# Altium schematic sheet Current_Sensors.SchDoc
size Letter
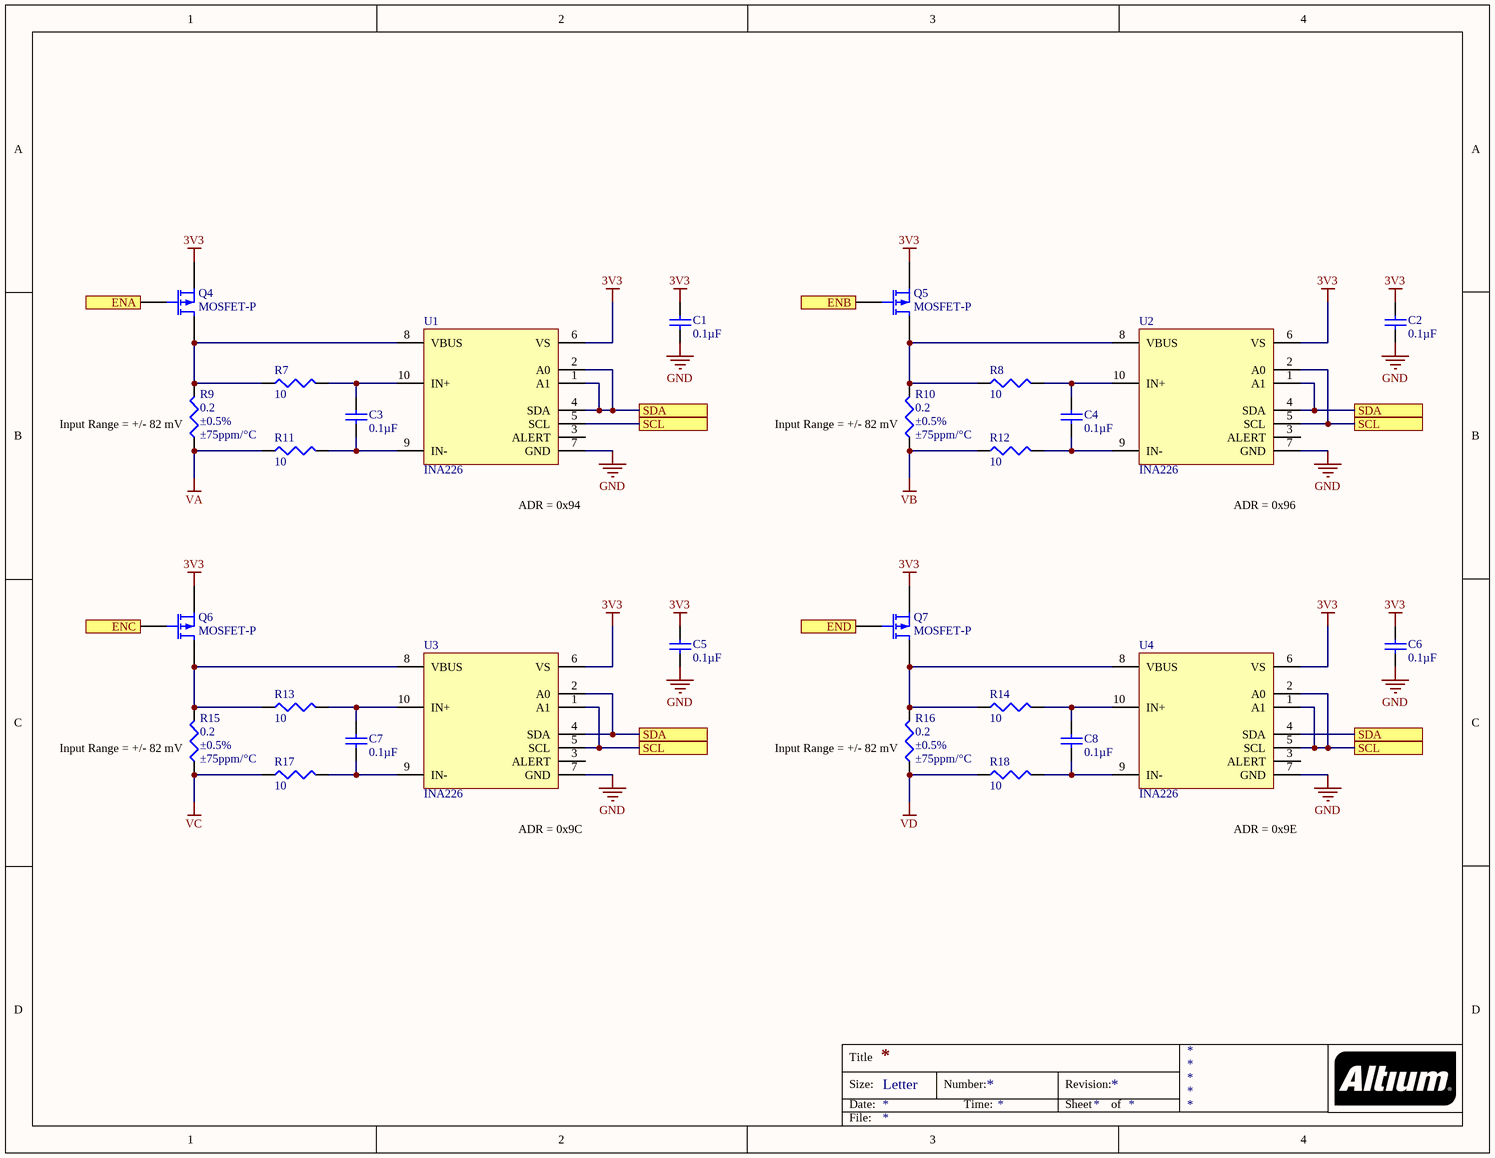
[diagram p0: Current_Sensors.SchDoc]

## Parts
C1  value 0.1µF  [TDK-CGA3E]  (hidden comment: Cap)
C2  value 0.1µF  [TDK-CGA3E]  (hidden comment: Cap)
C3  value 0.1µF  [TDK-CGA3E]  (hidden comment: Cap)
C4  value 0.1µF  [TDK-CGA3E]  (hidden comment: Cap)
C5  value 0.1µF  [TDK-CGA3E]  (hidden comment: Cap)
C6  value 0.1µF  [TDK-CGA3E]  (hidden comment: Cap)
C7  value 0.1µF  [TDK-CGA3E]  (hidden comment: Cap)
C8  value 0.1µF  [TDK-CGA3E]  (hidden comment: Cap)
Q4  MOSFET-P  [VSH-SO-8L]
Q5  MOSFET-P  [VSH-SO-8L]
Q6  MOSFET-P  [VSH-SO-8L]
Q7  MOSFET-P  [VSH-SO-8L]
R7  value 10  [PANA-ERA2A]  (hidden comment: Res3)
R8  value 10  [PANA-ERA2A]  (hidden comment: Res3)
R9  value 0.2  Tolerance: ±0.5%  Temperature Coefficient: ±75ppm/°C  [VSH-WSL2512]  (hidden comment: Res3)
R10  value 0.2  Tolerance: ±0.5%  Temperature Coefficient: ±75ppm/°C  [VSH-WSL2512]  (hidden comment: Res3)
R11  value 10  [PANA-ERA2A]  (hidden comment: Res3)
R12  value 10  [PANA-ERA2A]  (hidden comment: Res3)
R13  value 10  [PANA-ERA2A]  (hidden comment: Res3)
R14  value 10  [PANA-ERA2A]  (hidden comment: Res3)
R15  value 0.2  Tolerance: ±0.5%  Temperature Coefficient: ±75ppm/°C  [VSH-WSL2512]  (hidden comment: Res3)
R16  value 0.2  Tolerance: ±0.5%  Temperature Coefficient: ±75ppm/°C  [VSH-WSL2512]  (hidden comment: Res3)
R17  value 10  [PANA-ERA2A]  (hidden comment: Res3)
R18  value 10  [PANA-ERA2A]  (hidden comment: Res3)
U1  INA226  [TI-DGS]
U2  INA226  [TI-DGS]
U3  INA226  [TI-DGS]
U4  INA226  [TI-DGS]

## Ports
ENA, ENB, ENC, END, SCL, SDA

## Nets
3V3: C1.2 C2.2 C5.2 C6.2 Q4.3(S) Q5.3(S) Q6.3(S) Q7.3(S) U1.6(VS) U2.6(VS) U3.6(VS) U4.6(VS)
GND: C1.1 C2.1 C5.1 C6.1 U1.7(GND) U2.7(GND) U3.7(GND) U4.7(GND)
VA: R9.1 R11.1
VB: R10.1 R12.1
VC: R15.1 R17.1
VD: R16.1 R18.1
ENA: Q4.2(G) ; port ENA
ENB: Q5.2(G) ; port ENB
ENC: Q6.2(G) ; port ENC
END: Q7.2(G) ; port END
SCL: U1.5(SCL) U2.2(A0) U2.5(SCL) U3.1(A1) U3.5(SCL) U4.1(A1) U4.2(A0) U4.5(SCL) ; port SCL
SDA: U1.1(A1) U1.2(A0) U1.4(SDA) U2.1(A1) U2.4(SDA) U3.2(A0) U3.4(SDA) U4.4(SDA) ; port SDA
NetC3_1: C3.1 R11.2 U1.9(IN-)
NetC3_2: C3.2 R7.2 U1.10(IN+)
NetC4_1: C4.1 R12.2 U2.9(IN-)
NetC4_2: C4.2 R8.2 U2.10(IN+)
NetC7_1: C7.1 R17.2 U3.9(IN-)
NetC7_2: C7.2 R13.2 U3.10(IN+)
NetC8_1: C8.1 R18.2 U4.9(IN-)
NetC8_2: C8.2 R14.2 U4.10(IN+)
NetQ4_1: Q4.1(D) R7.1 R9.2 U1.8(VBUS)
NetQ5_1: Q5.1(D) R8.1 R10.2 U2.8(VBUS)
NetQ6_1: Q6.1(D) R13.1 R15.2 U3.8(VBUS)
NetQ7_1: Q7.1(D) R14.1 R16.2 U4.8(VBUS)

Not connected (* = marked no-connect by the designer): U1 3(ALERT); U2 3(ALERT); U3 3(ALERT); U4 3(ALERT)

## Notes on the sheet
- (near R9) Input Range = +/- 82 mV
- (near R10) Input Range = +/- 82 mV
- (near U1) ADR = 0x94
- (near U2) ADR = 0x96
- (near R15) Input Range = +/- 82 mV
- (near R16) Input Range = +/- 82 mV
- (near U3) ADR = 0x9C
- (near U4) ADR = 0x9E
- Title
- Size:
- Date:
- Letter
- Number:
- Time:
- Revision:
- Sheet
- of
- File:

## Library data of the parts
C1 C2 C5 C6 = PC-TDK-02273: CAP CER 0.1UF 50V X8R 0603; Manufacturer Part Number: CGA3E3X8R1H104M080AB; Index: 2273; Designator: C?; Tolerance: ±20%; Published: 3/16/2016; LatestRevisionDate: 3/16/2016; LatestRevisionNote: ...; PackageReference: 0603 (1608 Metric); Publisher: AlbertaSat; PackageDescription: Radial Cap, Thru-Hole; 2 Leads; 0.3 in Pin Spacing; Part Number: PC-TDK-02273; Supplier Part Number 1: 445-12607-1-ND; Supplier 1: Digi-key; Supplier Link: http://www.digikey.ca/product-search/en?keywords=445-12607-1-ND; Voltage - Rated: 50V; Temperature Coefficient: X8R; Applications: Automotive
C3 C4 C7 C8 = PC-TDK-02272: CAP CER 0.1UF 50V X8R 0603; Manufacturer Part Number: CGA3E3X8R1H104K080AB; Index: 2272; Designator: C?; Tolerance: ±10%; Published: 2016-03-16; LatestRevisionDate: 2016-03-16; LatestRevisionNote: ...; PackageReference: 0603 (1608 Metric); Publisher: AlbertaSat; PackageDescription: Radial Cap, Thru-Hole; 2 Leads; 0.3 in Pin Spacing; Part Number: PC-TDK-02272; Supplier Part Number 1: 445-12606-1-ND; Supplier 1: Digi-key; Supplier Link: http://www.digikey.ca/product-search/en?keywords=445-12606-1-ND; Voltage - Rated: 50V; Temperature Coefficient: X8R; Applications: Automotive
Q4-Q7 = PQ-VSH-00264: MOSFET P-CH 12V 60A POWERPAKSO-8; Manufacturer Part Number: SQJ411EP-T1_GE3; Index: 264; Designator: Q?; Published: 2018-03-27; LatestRevisionDate: 2018-03-27; LatestRevisionNote: ...; PackageVersion: 1995/1996; PackageReference: VSH-POWERPAKSO-8; Publisher: AlbertaSat; PackageDescription: SOIC, 8-Leads, Body 4.90x4.37mm, Pitch 1.27mm, Thermal Pad 4.07x3.63mm, IPC Low Density; Part Number: PQ-VSH-00264; Supplier Part Number 1: SQJ411EP-T1_GE3CT-ND; Supplier 1: Digi-key; Supplier Part Number 2: 78-SQJ411EP-T1_GE3; Supplier 2: Mouser; Supplier Link: #https://www.digikey.ca/product-detail/en/vishay-siliconix/SQJ411EP-T1_GE3/SQJ411EP-T1_GE3CT-ND/6709019#; Applications: Automotive
R7 R8 R11-R14 R17 R18 = 13235: RES SMD 10 OHM 0.5% 1/16W 0402; Part Number: 13235; Manufacturer Part Number: ERA-2AKD100X; Designator: R?; Power: 0.063W, 1/16W; Temperature Coefficient: ±100ppm/°C; Published: 8-Jun-2000; LatestRevisionDate: 29-May-2009; LatestRevisionNote: IPC-7351 Footprint Added.; PackageReference: 0402 (1005 Metric); Publisher: Altium Limited; PackageDescription: Chip Resistor, 2-Leads, Body 1.00x0.50mm, IPC Low Density; Supplier Part Number 1: P10DDCT-ND; Supplier 1: Digi-Key; Supplier Link: http://www.digikey.ca/product-search/en?keywords=P10DDCT-ND; Tolerance: ±0.5%
R9 R10 R15 R16 = PR-VSH-00260: Current Sense Resistors - SMD 1watt .2ohms .5% 2512; Manufacturer Part Number: WSL2512R2000DEA; Index: 260; Designator: R?; Power - Rated: 1W; Published: 2017-10-16; LatestRevisionDate: 2017-10-16; LatestRevisionNote: ...; PackageReference: VSH-WSL2512; Publisher: AlbertaSat; PackageDescription: Chip Resistor, 2-Leads, Body 6.35x3.18mm, IPC Low Density; Part Number: PR-VSH-00260; Supplier Part Number 1: 71-WSL2512R2000DEA; Supplier 1: Mouser; Supplier Link: #https://ca.mouser.com/ProductDetail/Vishay-Dale/WSL2512R2000DEA?qs=sGAEpiMZZMtlleCFQhR%2fzZ%252bPyWemVGq4IOcPPigD2d8%3d#; Applications: Automotive
U1-U4 = 19: IC MONITOR PWR/CURR BIDIR 10MSOP; Part Number: 19; Manufacturer Part Number: INA226AQDGSRQ1; Designator: U?; Supplier Part Number 2: 595-INA226AQDGSRQ1; Supplier 2: Mouser; Supplier Part Number 1: 296-42503-1-ND; Supplier 1: Digi-Key; Supplier Link: #https://www.digikey.com/product-detail/en/texas-instruments/INA226AQDGSRQ1/296-42503-1-ND/5416001#; PackageReference: TI-MSOP10